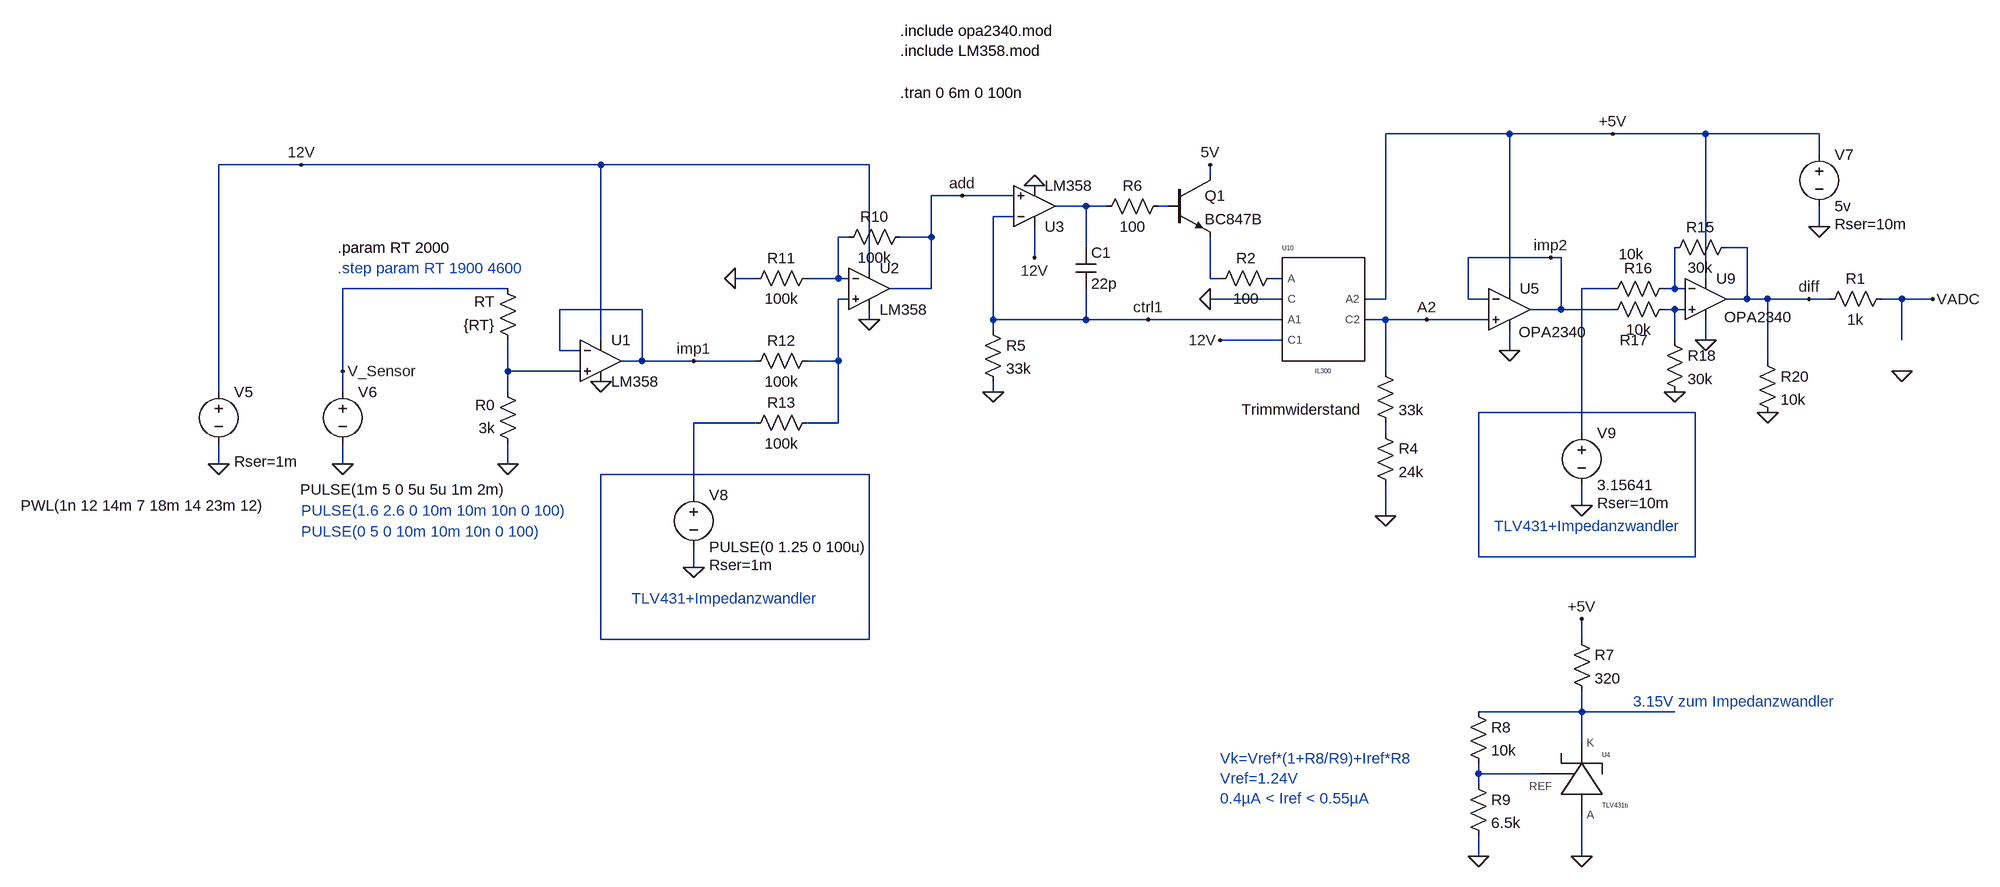
[diagram p0: schematic IL300_F-107_12V+npn_KTY19_version.asc]
IL300_F-107_12V+npn_KTY19_version.asc, the LTspice schematic file:
Version 4
SHEET 1 6832 5392
WIRE 736 304 544 304
WIRE 896 304 736 304
WIRE 1040 304 896 304
WIRE 1216 304 1040 304
WIRE 1216 336 1216 304
WIRE -1136 352 -1264 352
WIRE -672 352 -1136 352
WIRE -256 352 -672 352
WIRE 272 368 272 352
WIRE -112 400 -160 400
WIRE -32 400 -112 400
WIRE 80 416 32 416
WIRE 112 416 80 416
WIRE 208 416 192 416
WIRE -32 432 -64 432
WIRE 1216 448 1216 416
WIRE -288 464 -304 464
WIRE -160 464 -160 400
WIRE -160 464 -208 464
WIRE 80 480 80 416
WIRE 1104 480 1072 480
WIRE 0 496 0 448
WIRE 800 496 672 496
WIRE 816 496 800 496
WIRE -256 512 -256 352
WIRE -432 528 -464 528
WIRE -304 528 -304 464
WIRE -304 528 -352 528
WIRE -288 528 -304 528
WIRE 272 528 272 464
WIRE 288 528 272 528
WIRE 384 528 368 528
WIRE 1040 528 1040 304
WIRE -816 544 -1072 544
WIRE -160 544 -160 464
WIRE -160 544 -224 544
WIRE 736 544 736 304
WIRE 896 544 848 544
WIRE 992 544 992 480
WIRE 992 544 976 544
WIRE 1008 544 992 544
WIRE -288 560 -304 560
WIRE 384 560 272 560
WIRE 544 560 544 304
WIRE 544 560 512 560
WIRE 672 560 672 496
WIRE 704 560 672 560
WIRE 1104 560 1104 480
WIRE 1104 560 1072 560
WIRE 1136 560 1104 560
WIRE 1200 560 1136 560
WIRE 1232 560 1200 560
WIRE 1344 560 1312 560
WIRE 1392 560 1344 560
WIRE -608 576 -736 576
WIRE 816 576 816 496
WIRE 816 576 768 576
WIRE 896 576 816 576
WIRE 992 576 976 576
WIRE 1008 576 992 576
WIRE -256 592 -256 576
WIRE -64 592 -64 432
WIRE 80 592 80 544
WIRE 80 592 -64 592
WIRE 176 592 80 592
WIRE 384 592 176 592
WIRE 544 592 512 592
WIRE 608 592 544 592
WIRE 704 592 608 592
WIRE -64 608 -64 592
WIRE -672 624 -672 352
WIRE 384 624 288 624
WIRE 992 624 992 576
WIRE 1040 624 1040 592
WIRE 1344 624 1344 560
WIRE -736 640 -736 576
WIRE -704 640 -736 640
WIRE 736 640 736 608
WIRE -608 656 -608 576
WIRE -608 656 -640 656
WIRE -528 656 -608 656
WIRE -432 656 -528 656
WIRE -304 656 -304 560
WIRE -304 656 -352 656
WIRE 1136 656 1136 560
WIRE -1072 672 -1072 544
WIRE -816 672 -816 624
WIRE -704 672 -816 672
WIRE 544 672 544 592
WIRE -1264 704 -1264 352
WIRE -1072 704 -1072 672
WIRE -816 704 -816 672
WIRE -64 704 -64 688
WIRE 1024 736 688 736
WIRE -432 752 -528 752
WIRE -304 752 -304 656
WIRE -304 752 -352 752
WIRE 544 768 544 752
WIRE 848 768 848 544
WIRE -1264 816 -1264 784
WIRE -1072 816 -1072 784
WIRE -816 816 -816 784
WIRE -256 832 -672 832
WIRE -528 864 -528 752
WIRE 848 880 848 848
WIRE 544 896 544 848
WIRE 688 960 688 736
WIRE 1024 960 1024 736
WIRE 1024 960 688 960
WIRE -528 976 -528 944
WIRE -672 1088 -672 832
WIRE -256 1088 -256 832
WIRE -256 1088 -672 1088
WIRE 848 1088 848 1056
WIRE 848 1200 848 1168
WIRE 848 1200 688 1200
WIRE 992 1200 848 1200
WIRE 848 1248 848 1200
WIRE 688 1296 688 1280
WIRE 784 1296 688 1296
WIRE 688 1312 688 1296
WIRE 688 1424 688 1392
WIRE 848 1424 848 1360
FLAG -1072 816 0
FLAG -1264 816 0
FLAG 544 896 0
FLAG 0 384 0
FLAG -64 704 0
FLAG 272 560 0
FLAG 1216 448 0
FLAG 736 640 0
FLAG -1072 672 V_Sensor
FLAG -816 816 0
FLAG -672 688 0
FLAG -256 592 0
FLAG -464 528 0
FLAG -528 976 0
FLAG 1040 624 0
FLAG 848 880 0
FLAG 992 704 0
FLAG 1136 736 0
FLAG 0 496 12V
FLAG 288 624 12V
FLAG 1344 672 0
FLAG 272 352 5V
FLAG -1136 352 12V
FLAG -528 656 imp1
FLAG -112 400 add
FLAG 176 592 ctrl1
FLAG 608 592 A2
FLAG 800 496 imp2
FLAG 1392 560 VADC
FLAG 1200 560 diff
FLAG 848 1424 0
FLAG 688 1424 0
FLAG 896 304 +5V
FLAG 848 1056 +5V
SYMBOL res 528 656 R0
WINDOW 0 -207 75 Left 2
SYMATTR InstName Trimmwiderstand
SYMATTR Value 33k
SYMBOL voltage -1264 688 R0
WINDOW 123 0 0 Left 2
WINDOW 39 24 124 Left 2
WINDOW 3 -307 192 Left 2
SYMATTR SpiceLine Rser=1m
SYMATTR Value PWL(1n 12 14m 7 18m 14 23m 12)
SYMATTR InstName V5
SYMBOL voltage -1072 688 R0
WINDOW 123 24 44 Left 2
WINDOW 39 24 72 Left 2
WINDOW 3 -66 167 Left 2
SYMATTR Value PULSE(1m 5 0 5u 5u 1m 2m)
SYMATTR InstName V6
SYMBOL res -80 592 R0
SYMATTR InstName R5
SYMATTR Value 33k
SYMBOL res 208 400 R90
WINDOW 0 0 56 VBottom 2
WINDOW 3 32 56 VTop 2
SYMATTR InstName R6
SYMATTR Value 100
SYMBOL voltage 1216 320 R0
WINDOW 123 0 0 Left 2
WINDOW 39 24 124 Left 2
SYMATTR SpiceLine Rser=10m
SYMATTR InstName V7
SYMATTR Value 5v
SYMBOL Opamps\\opamp2 736 512 R0
WINDOW 38 14 99 Left 2
SYMATTR SpiceModel OPA2340
SYMATTR InstName U5
SYMATTR Value ""
SYMBOL res -800 640 R180
WINDOW 0 36 76 Left 2
WINDOW 3 36 40 Left 2
SYMATTR InstName RT
SYMATTR Value {RT}
SYMBOL res -800 800 R180
WINDOW 0 36 76 Left 2
WINDOW 3 36 40 Left 2
SYMATTR InstName R0
SYMATTR Value 3k
SYMBOL res -192 448 R90
WINDOW 0 0 56 VBottom 2
WINDOW 3 32 56 VTop 2
SYMATTR InstName R10
SYMATTR Value 100k
SYMBOL res -336 512 R90
WINDOW 0 0 56 VBottom 2
WINDOW 3 32 56 VTop 2
SYMATTR InstName R11
SYMATTR Value 100k
SYMBOL res -336 640 R90
WINDOW 0 0 56 VBottom 2
WINDOW 3 32 56 VTop 2
SYMATTR InstName R12
SYMATTR Value 100k
SYMBOL res -336 736 R90
WINDOW 0 0 56 VBottom 2
WINDOW 3 32 56 VTop 2
SYMATTR InstName R13
SYMATTR Value 100k
SYMBOL voltage -528 848 R0
WINDOW 123 0 0 Left 2
WINDOW 39 24 124 Left 2
SYMATTR SpiceLine Rser=1m
SYMATTR InstName V8
SYMATTR Value PULSE(0 1.25 0 100u)
SYMBOL Opamps\\opamp2 1040 496 R0
WINDOW 38 29 92 Left 2
SYMATTR SpiceModel OPA2340
SYMATTR InstName U9
SYMATTR Value ""
SYMBOL res 976 496 R270
WINDOW 0 32 56 VTop 2
WINDOW 3 0 56 VBottom 2
SYMATTR InstName R15
SYMATTR Value 30k
SYMBOL res 880 560 R270
WINDOW 0 32 56 VTop 2
WINDOW 3 85 45 VBottom 2
SYMATTR InstName R16
SYMATTR Value 10k
SYMBOL res 880 592 R270
WINDOW 0 -47 49 VTop 2
WINDOW 3 0 56 VBottom 2
SYMATTR InstName R17
SYMATTR Value 10k
SYMBOL res 976 608 R0
SYMATTR InstName R18
SYMATTR Value 30k
SYMBOL voltage 848 752 R0
WINDOW 123 0 0 Left 2
WINDOW 39 24 124 Left 2
SYMATTR SpiceLine Rser=10m
SYMATTR InstName V9
SYMATTR Value 3.15641
SYMBOL IL300 448 576 R0
SYMATTR InstName U10
SYMBOL res 1120 640 R0
SYMATTR InstName R20
SYMATTR Value 10k
SYMBOL cap 64 480 R0
SYMATTR InstName C1
SYMATTR Value 22p
SYMBOL res 1328 544 R90
WINDOW 0 0 56 VBottom 2
WINDOW 3 32 56 VTop 2
SYMATTR InstName R1
SYMATTR Value 1k
SYMBOL npn 208 368 R0
SYMATTR InstName Q1
SYMATTR Value BC847B
SYMBOL res 272 544 R270
WINDOW 0 32 56 VTop 2
WINDOW 3 0 56 VBottom 2
SYMATTR InstName R2
SYMATTR Value 100
SYMBOL res 528 752 R0
SYMATTR InstName R4
SYMATTR Value 24k
SYMBOL res 832 1072 R0
SYMATTR InstName R7
SYMATTR Value 320
SYMBOL res 672 1184 R0
SYMATTR InstName R8
SYMATTR Value 10k
SYMBOL res 672 1296 R0
SYMATTR InstName R9
SYMATTR Value 6.5k
SYMBOL TLV431TI 848 1312 R0
SYMATTR InstName U4
SYMBOL Opamps\\opamp2 -672 592 R0
SYMATTR InstName U1
SYMATTR Value LM358
SYMBOL Opamps\\opamp2 -256 480 R0
SYMATTR InstName U2
SYMATTR Value LM358
SYMBOL Opamps\\opamp2 0 480 M180
SYMATTR InstName U3
SYMATTR Value LM358
TEXT -1136 920 Left 2 ;PULSE(0 5 0 10m 10m 10n 0 100)
TEXT -208 240 Left 2 !.tran 0 6m 0 100n
TEXT -1136 888 Left 2 ;PULSE(1.6 2.6 0 10m 10m 10n 0 100)
TEXT -624 1024 Left 2 ;TLV431+Impedanzwandler
TEXT 712 912 Left 2 ;TLV431+Impedanzwandler
TEXT -1080 512 Left 2 ;.step param RT 1900 4600
TEXT -1080 480 Left 2 !.param RT 2000
TEXT -208 144 Left 2 !.include opa2340.mod\n.include LM358.mod
TEXT 928 1184 Left 2 ;3.15V zum Impedanzwandler
TEXT 288 1272 Left 2 ;Vk=Vref*(1+R8/R9)+Iref*R8\nVref=1.24V\n0.4µA < Iref < 0.55µA

The netlist it stands for:
* IL300_F-107_12V+npn_KTY19_version.asc
R§Trimmwiderstand A2 N013 33k
V5 12V 0 PWL(1n 12 14m 7 18m 14 23m 12) Rser=1m
V6 V_Sensor 0 PULSE(1m 5 0 5u 5u 1m 2m)
R5 ctrl1 0 33k
R6 N002 N001 100
V7 +5V 0 5v Rser=10m
XU5 A2 imp2 +5V 0 imp2 OPA2340  ; pins In+ In- V+ V- OUT
RT N010 V_Sensor {RT}
R0 0 N010 3k
R10 add N003 100k
R11 N003 0 100k
R12 N008 imp1 100k
R13 N008 N012 100k
V8 N012 0 PULSE(0 1.25 0 100u) Rser=1m
XU9 N009 N007 +5V 0 diff OPA2340  ; pins In+ In- V+ V- OUT
R15 N007 diff 30k
R16 N006 N007 10k
R17 imp2 N009 10k
R18 N009 0 30k
V9 N006 0 3.15641 Rser=10m
XU10 N005 0 ctrl1 12V +5V A2 IL300 IL300  ; pins A C A1 C1 A2 C2
R20 diff 0 10k
C1 N001 ctrl1 22p
R1 VADC diff 1k
Q1 5V N002 N004 0 BC847B
R2 N004 N005 100
R4 N013 0 24k
R7 +5V N015 320
R8 N015 N016 10k
R9 N016 0 6.5k
XU4 N015 0 N016 TLV431TI  ; pins K A REF
XU1 N010 imp1 12V 0 imp1 LM358  ; pins In+ In- V+ V- OUT
XU2 N008 N003 12V 0 add LM358  ; pins In+ In- V+ V- OUT
XU3 add ctrl1 12V 0 N001 LM358  ; pins In+ In- V+ V- OUT
.model NPN NPN
.model PNP PNP
.lib standard.bjt
* PULSE(0 5 0 10m 10m 10n 0 100)
.tran 0 6m 0 100n
* PULSE(1.6 2.6 0 10m 10m 10n 0 100)
* TLV431+Impedanzwandler
* TLV431+Impedanzwandler
* .step param RT 1900 4600
.param RT 2000
.include opa2340.mod
.include LM358.mod
* 3.15V zum Impedanzwandler
* Vk=Vref*(1+R8/R9)+Iref*R8
* Vref=1.24V
* 0.4µA < Iref < 0.55µA
.lib IL300.sub
.lib tlv431ti.lib
.backanno
.end